# EAGLE design adapter_board (EAGLE 5.03)
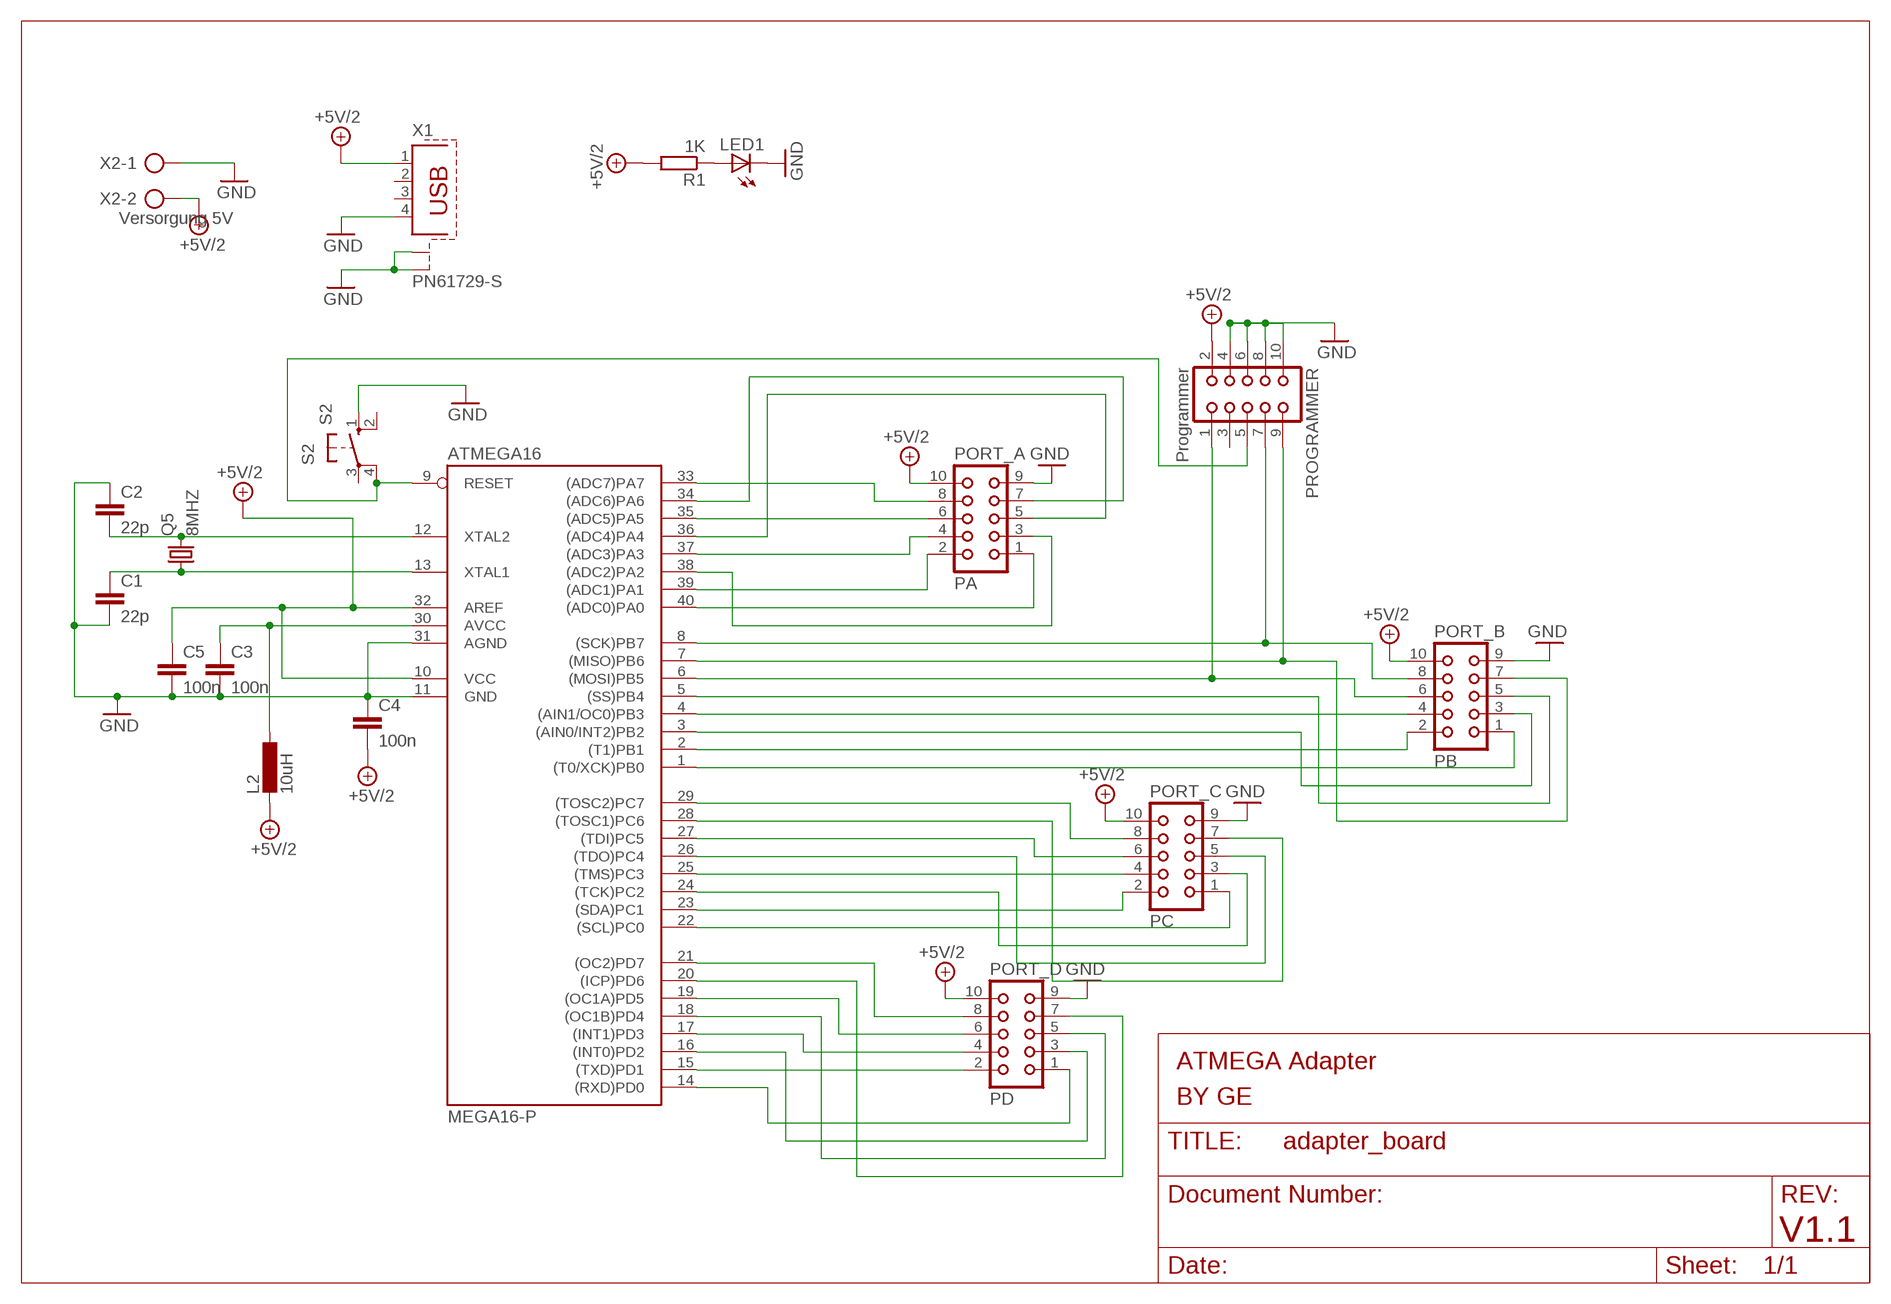
[diagram p0: schematic, sheet 1]

## Parts
ATMEGA16  MEGA16-P  [DIL40]
C1  22p  C2.5/2  [C2.5-2]
C2  22p  C2.5/2  [C2.5-2]
C3  100n  C5/2.5  [C5B2.5]
C4  100n  C2.5/2  [C2.5-2]
C5  100n  C2.5/2  [C2.5-2]
L2  10uH  L-EU0204/5  [0204/5]
LED1  LED3MM  [LED3MM]
PORT_A  PA  CON10  [CON10]
PORT_B  PB  CON10  [CON10]
PORT_C  PC  CON10  [CON10]
PORT_D  PD  CON10  [CON10]
PROGRAMMER  Programmer  CON10  [CON10]
Q5  8MHZ  CRYTALHC18U-V  [HC18U-V]
R1  1K  R-EU_0204/2V  [0204V]
S2  S2  10-XX  [B3F-10XX]
X1  PN61729-S  [PN61729-S]
X2  Versorgung 5V  AK300/2  [AK300/2]

## Nets
2D30: ATMEGA16.30(AVCC) C3.1 L2.1
+5V/2: ATMEGA16.10(VCC) ATMEGA16.32(AREF) C4.2 C5.1 L2.2 PORT_A.10 PORT_B.10 PORT_C.10 PORT_D.10 PROGRAMMER.2 R1.2 X1.1 X2.2
GND: ATMEGA16.11(GND) ATMEGA16.31(AGND) C1.2 C2.1 C3.2 C4.1 C5.2 LED1.K(C) PORT_A.9 PORT_B.9 PORT_C.9 PORT_D.9 PROGRAMMER.4 PROGRAMMER.6 PROGRAMMER.8 PROGRAMMER.10 S2.1(S) X1.4 X1.S1 X1.S2 X2.1
N$1: ATMEGA16.12(XTAL2) C2.2 Q5.2
N$2: ATMEGA16.13(XTAL1) C1.1 Q5.1
N$3: ATMEGA16.9(RESET) PROGRAMMER.5 S2.4(P1)
N$4: ATMEGA16.1((T0/XCK)PB0) PORT_B.1
N$5: ATMEGA16.2((T1)PB1) PORT_B.2
N$6: ATMEGA16.3((AIN0/INT2)PB2) PORT_B.3
N$7: ATMEGA16.4((AIN1/OC0)PB3) PORT_B.4
N$8: ATMEGA16.5((SS)PB4) PORT_B.5
N$9: ATMEGA16.6((MOSI)PB5) PORT_B.6 PROGRAMMER.1
N$10: ATMEGA16.7((MISO)PB6) PORT_B.7 PROGRAMMER.9
N$11: ATMEGA16.8((SCK)PB7) PORT_B.8 PROGRAMMER.7
N$12: ATMEGA16.22((SCL)PC0) PORT_C.1
N$13: ATMEGA16.23((SDA)PC1) PORT_C.2
N$14: ATMEGA16.24((TCK)PC2) PORT_C.3
N$15: ATMEGA16.25((TMS)PC3) PORT_C.4
N$16: ATMEGA16.26((TDO)PC4) PORT_C.5
N$17: ATMEGA16.27((TDI)PC5) PORT_C.6
N$18: ATMEGA16.28((TOSC1)PC6) PORT_C.7
N$19: ATMEGA16.29((TOSC2)PC7) PORT_C.8
N$20: ATMEGA16.14((RXD)PD0) PORT_D.1
N$21: ATMEGA16.15((TXD)PD1) PORT_D.2
N$22: ATMEGA16.16((INT0)PD2) PORT_D.3
N$23: ATMEGA16.17((INT1)PD3) PORT_D.4
N$24: ATMEGA16.18((OC1B)PD4) PORT_D.5
N$25: ATMEGA16.19((OC1A)PD5) PORT_D.6
N$26: ATMEGA16.20((ICP)PD6) PORT_D.7
N$27: ATMEGA16.21((OC2)PD7) PORT_D.8
N$28: ATMEGA16.40((ADC0)PA0) PORT_A.1
N$29: ATMEGA16.39((ADC1)PA1) PORT_A.2
N$30: ATMEGA16.38((ADC2)PA2) PORT_A.3
N$31: ATMEGA16.37((ADC3)PA3) PORT_A.4
N$32: ATMEGA16.36((ADC4)PA4) PORT_A.5
N$33: ATMEGA16.35((ADC5)PA5) PORT_A.6
N$34: ATMEGA16.34((ADC6)PA6) PORT_A.7
N$35: ATMEGA16.33((ADC7)PA7) PORT_A.8
N$36: LED1.A R1.1
Unconnected: PROGRAMMER.3 S2.2(S1) S2.3(P) X1.2 X1.3

## Notes on the sheet
- ATMEGA Adapter
- BY GE
- V1.1

## Library data of the parts
ATMEGA16 = atmel:MEGA16-P: MICROCONTROLLER 16 Kbytes FLASH 1 kbytes SRAM 512 bytes EEPROM USART 8-channel 10 bit ADC Source: avr.lbr
C1-C5 = capacitor-wima:C: CAPACITOR naming: grid - package width
L2 = rcl:L-EU: INDUCTOR, European symbol
LED1 = led:LED: LED OSRAM: - CHIPLED LG R971, LG N971, LY N971, LG Q971, LY Q971, LO R971, LY R971 LH N974, LH R974 LS Q976, LO Q976, LY Q976 LO Q996 - Hyper CHIPLED LW Q18S LB Q993, LB Q99A, LB R99A - SideLED LS A670, LO A670, LY A670, LG A670, LP A670 LB A673, LV A673, LT A673, LW A673 LH A674 LY A675 LS A676, LA A676, LO A676, LY A676, LW A676 LS A679, LY A679, LG A679 - Hyper Micro SIDELED® LS Y876, LA Y876, LO Y876, LY Y876 LT Y87S - SmartLED LW L88C, LW L88S LB L89C, LB L89S, LG L890 LS L89K, LO L89K, LY L89K LS L896, LA L896, LO L896, LY L896 - TOPLED LS T670, LO T670, LY T670, LG T670, LP T670 LSG T670, LSP T670, LSY T670, LOP T670, LYG T670 LG T671, LOG T671, LSG T671 LB T673, LV T673, LT T673, LW T673 LH T674 LS T676, LA T676, LO T676, LY T676, LB T676, LH T676, LSB T676, LW T676 LB T67C, LV T67C, LT T67C, LS T67K, LO T67K, LY T67K, LW E67C LS E67B, LA E67B, LO E67B, LY E67B, LB E67C, LV E67C, LT E67C LW T67C LS T679, LY T679, LG T679 LS T770, LO T770, LY T770, LG T770, LP T770 LB T773, LV T773, LT T773, LW T773 LH T774 LS E675, LA E675, LY E675, LS T675 LS T776, LA T776, LO T776, LY T776, LB T776 LHGB T686 LT T68C, LB T68C - Hyper Mini TOPLED® LB M676 - Mini TOPLED Santana® LG M470 LS M47K, LO M47K, LY M47K Source: http://www.osram.convergy.de LUXEON: - LUMILED® LXK2-PW12-R00, LXK2-PW12-S00, LXK2-PW14-U00, LXK2-PW14-V00 LXK2-PM12-R00, LXK2-PM12-S00, LXK2-PM14-U00 LXK2-PE12-Q00, LXK2-PE12-R00, LXK2-PE12-S00, LXK2-PE14-T00, LXK2-PE14-U00 LXK2-PB12-K00, LXK2-PB12-L00, LXK2-PB12-M00, LXK2-PB14-N00, LXK2-PB14-P00, LXK2-PB14-Q00 LXK2-PR12-L00, LXK2-PR12-M00, LXK2-PR14-Q00, LXK2-PR14-R00 LXK2-PD12-Q00, LXK2-PD12-R00, LXK2-PD12-S00 LXK2-PH12-R00, LXK2-PH12-S00 LXK2-PL12-P00, LXK2-PL12-Q00, LXK2-PL12-R00 Source: www.luxeon.com KINGBRIGHT: KA-3528ASYC Source: www.kingbright.com
PORT_A PORT_B PORT_C PORT_D PROGRAMMER = con-harting:CON10: CONNECTOR
Q5 = crystal:CRYTAL: CRYSTAL
R1 = rcl:R-EU_: RESISTOR, European symbol
S2 = switch-omron:10-XX: OMRON SWITCH
X1 = con-berg:PN61729-S: BERG USB connector
X2 = con-ptr500:AK300/2: CONNECTOR

## Board
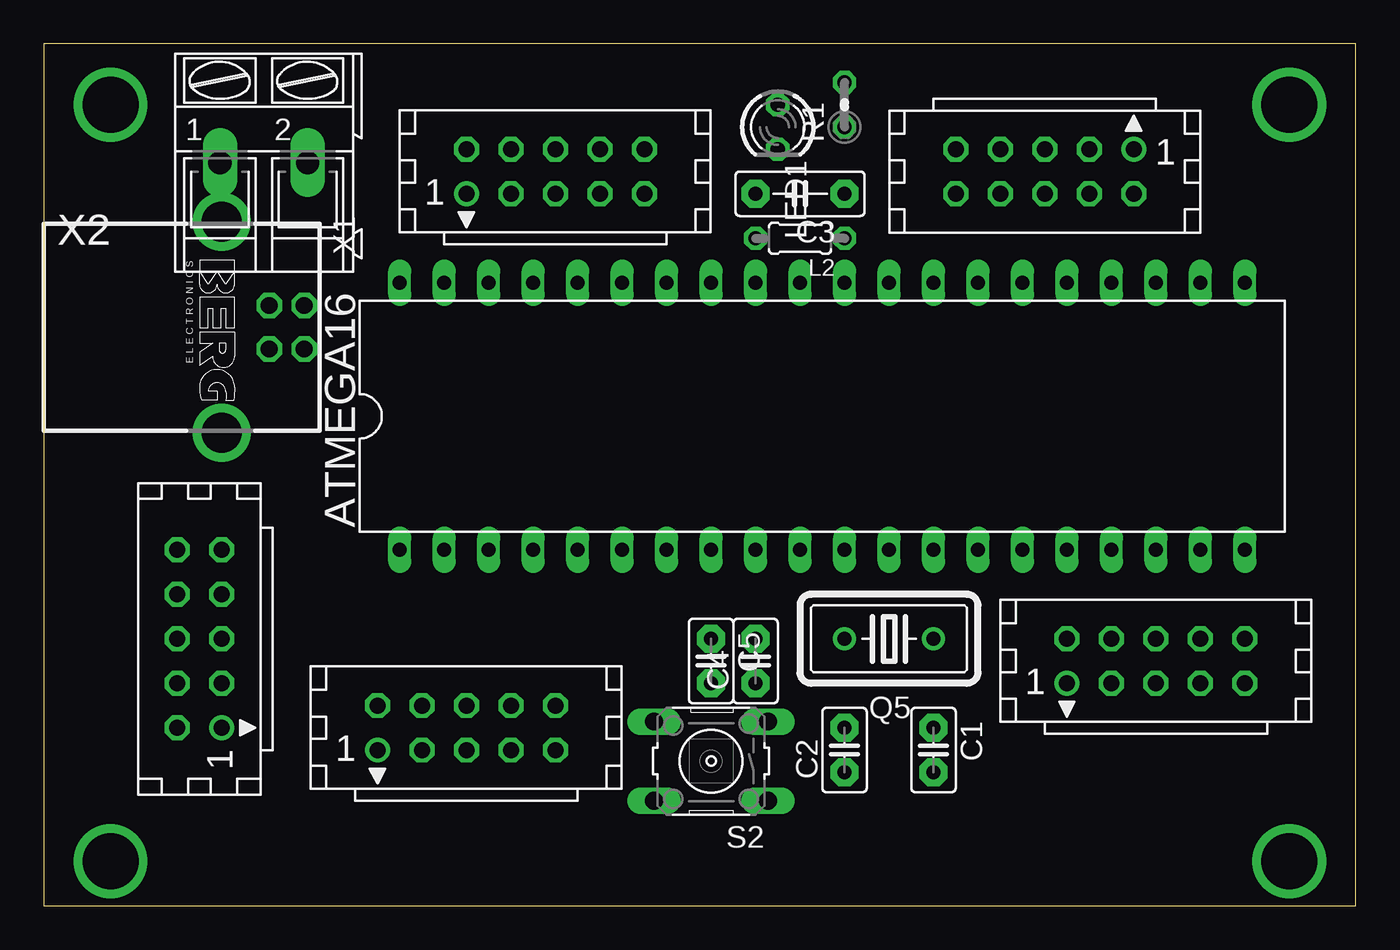
[diagram p1: board, top side]
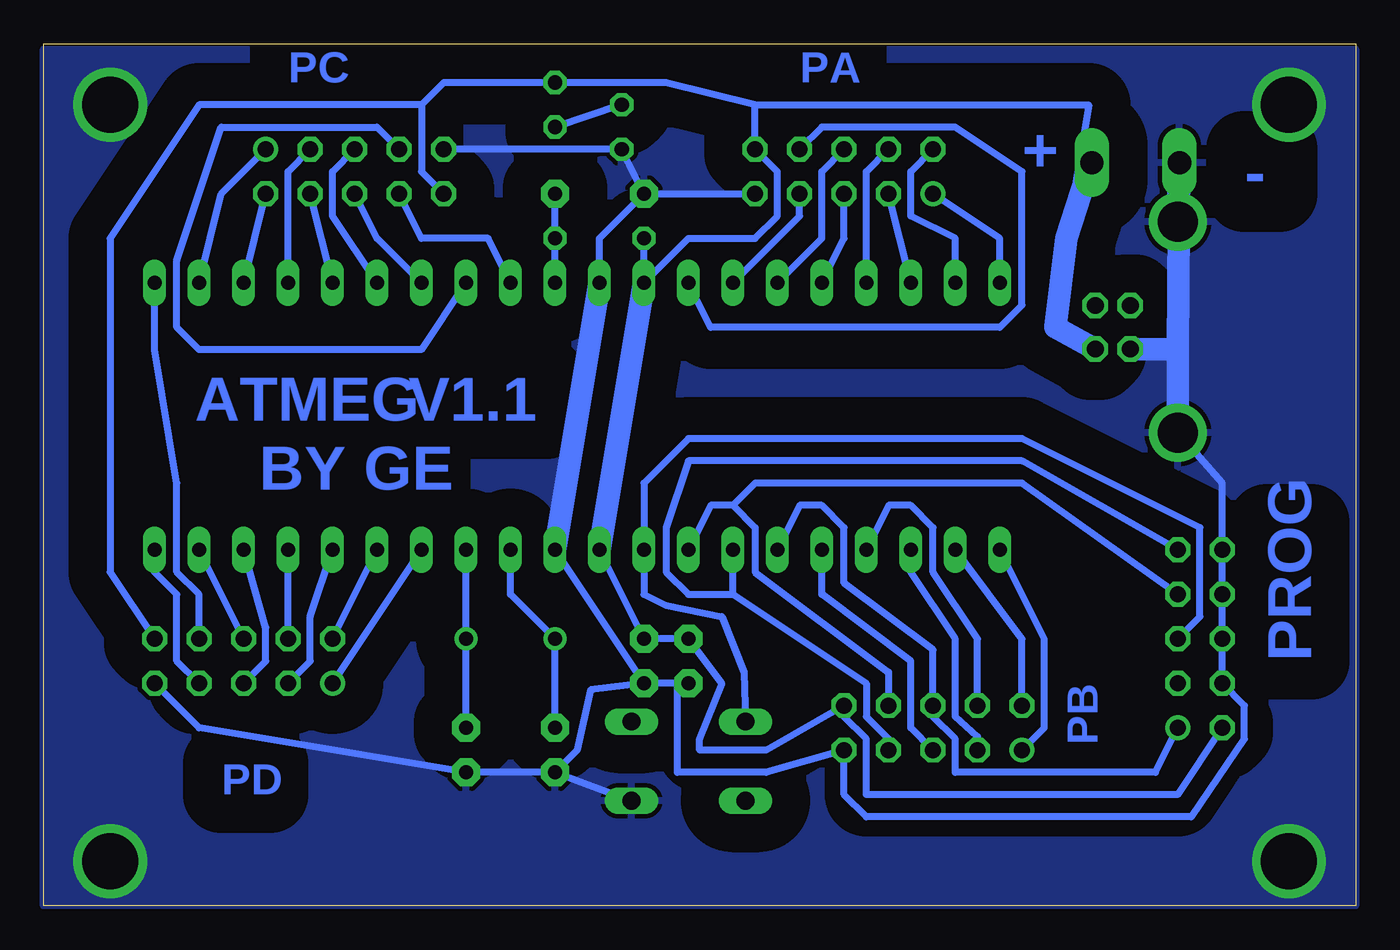
[diagram p2: board, bottom side, seen from below]

Size 74.91 x 49.2 mm. Coordinates in mm from the lower left corner, seen from the top.
Outline: 0,0 74.91,0 74.91,49.2 0,49.2 0,0
Copper layers (1*16): Top 0.035mm / dielectric 1.5mm / Bottom 0.035mm
Design rules "0.35mm": minimum track width 10mil, minimum drill 24mil, track to track 0.35mm, track to pad 0.35mm, pad to pad 0.35mm, via to via 0.35mm, smd to smd 0.35mm, copper to edge 0mil, drill to drill 8mil, minimum pad ring 10mil, minimum via ring 8mil, stop-mask expansion 4mil, vias tented up to drill 0mil, thermal gap 10mil

### Footprints (pad centres in the part's own frame; a part is rotated, then mirrored left to right if it is on the bottom)
DIL40 = drill 0.813 long: 1 -24.13,-7.62; 2 -21.59,-7.62; 3 -19.05,-7.62; 4 -16.51,-7.62; 5 -13.97,-7.62; 6 -11.43,-7.62; 7 -8.89,-7.62; 8 -6.35,-7.62; 9 -3.81,-7.62; 10 -1.27,-7.62; 11 1.27,-7.62; 12 3.81,-7.62; 13 6.35,-7.62; 14 8.89,-7.62; 15 11.43,-7.62; 16 13.97,-7.62; 17 16.51,-7.62; 18 19.05,-7.62; 19 21.59,-7.62; 20 24.13,-7.62; 21 24.13,7.62; 22 21.59,7.62; 23 19.05,7.62; 24 16.51,7.62; 25 13.97,7.62; 26 11.43,7.62; 27 8.89,7.62; 28 6.35,7.62; 29 3.81,7.62; 30 1.27,7.62; 31 -1.27,7.62; 32 -3.81,7.62; 33 -6.35,7.62; 34 -8.89,7.62; 35 -11.43,7.62; 36 -13.97,7.62; 37 -16.51,7.62; 38 -19.05,7.62; 39 -21.59,7.62; 40 -24.13,7.62
C2.5-2 = drill 0.813 pad 1.6 octagon: 1 -1.27,0; 2 1.27,0
C5B2.5 = drill 0.813 pad 1.6 octagon: 1 -2.54,0; 2 2.54,0
0204/5 = drill 0.813 octagon: 1 -2.54,0; 2 2.54,0
LED3MM = drill 0.813 octagon: A -1.27,0; K 1.27,0
CON10 = drill 0.914 round: 1 -5.08,-1.27 | drill 0.914 octagon: 2 -5.08,1.27; 3 -2.54,-1.27; 4 -2.54,1.27; 5 0,-1.27; 6 0,1.27; 7 2.54,-1.27; 8 2.54,1.27; 9 5.08,-1.27; 10 5.08,1.27
HC18U-V = drill 0.813 round: 1 -2.54,0; 2 2.54,0
0204V = drill 0.813 octagon: 1 -1.27,0; 2 1.27,0
B3F-10XX = drill 1.016 long: 1 -3.251,2.261; 2 3.251,2.261; 3 -3.251,-2.261; 4 3.251,-2.261
PN61729-S = drill 0.95 octagon: 1 1.25,4.71; 2 -1.25,4.71; 3 -1.25,2.71; 4 1.25,2.71 | drill 2.3 pad 2.9 round: S1 -6.02,0; S2 6.02,0
AK300/2 = drill 1.321 long: 1 -2.515,0; 2 2.489,0

### Placement (x,y rotation side)
ATMEGA16  44.45,27.94 0 top
C1  50.8,8.89 270 top
C2  45.72,8.89 90 top
C3  43.18,40.64 180 top
C4  40.64,13.97 90 top
C5  38.1,13.97 270 top
L2  43.18,38.1 180 top
LED1  41.91,44.45 270 top
PORT_A  29.21,41.91 0 top
PORT_B  24.13,10.16 0 top
PORT_C  57.15,41.91 180 top
PORT_D  63.5,13.97 0 top
PROGRAMMER  8.89,15.24 90 top
Q5  48.26,15.24 180 top
R1  45.72,45.72 90 top
S2  38.1,8.26 180 top
X1  10.16,33.02 270 top
X2  12.57,42.42 0 top

### Tracks (layer width: path | path; a pad name or v marks a point on that pad's centre or on a via)
2D30
  Bottom 0.406: ATMEGA16.30 L2.1 C3.1
+5V/2
  Bottom 0.406: L2.2 ATMEGA16.32 38.1,38.1 34.29,38.1 33.02,39.37 33.02,41.91 PORT_A.10 34.29,45.72 | PORT_C.10 53.34,41.91 53.34,45.72 | 34.29,45.72 39.37,46.99 R1.2 52.07,46.99 53.34,45.72 | ATMEGA16.10 C4.2 C5.1 36.2,12.7 37.47,9.53 37.47,8.89 33.66,8.89 PORT_B.10 29.21,10.79 27.94,9.53 27.94,6.35 10.16,6.35 PROGRAMMER.2 | 16.51,38.1 15.24,45.72 34.29,45.72 | PORT_D.10 71.12,19.05 71.12,38.1 66.04,45.72 53.34,45.72
  Bottom 1.27: ATMEGA16.10 ATMEGA16.32 | X2.2 15.12,42.44 16.51,38.1 17.14,33.02 X1.1
GND  (via drill 3.2, 3.2 pad 1.27)
  Bottom 0.406: C2.1 S2.1 | C2.1 C1.2 66.04,10.16 PORT_D.9 | C3.2 PORT_A.9 | ATMEGA16.31 43.18,38.1 C3.2 | PORT_C.9 LED1.K C3.2 | C4.1 ATMEGA16.11 | 38.73,12.7 C4.1 | 38.73,12.7 38.73,7.62 33.66,7.62 PORT_B.9 29.21,6.35 27.94,5.08 9.4,5.08 6.35,9.53 6.35,11.43 PROGRAMMER.4 PROGRAMMER.6 PROGRAMMER.8 PROGRAMMER.10 7.62,24.13 X1.S2 | 38.73,12.7 C5.2 | C4.1 43.69,12.32 44.45,8.89 C2.1
  Bottom 1.27: ATMEGA16.11 ATMEGA16.31 | X1.S2 10.17,31.75 | 10.17,31.75 X2.1 X1.S1 | 10.17,31.75 X1.4
  other vias: 3.81,45.72 3.81,2.54 71.12,2.54 71.12,45.72
  pour Bottom (isolate 2.184): 0,0 74.93,0 74.93,48.9 0,48.9
N$1
  Bottom 0.406: ATMEGA16.12 48.26,17.78 Q5.2 C2.2
N$2
  Bottom 0.406: ATMEGA16.13 Q5.1 C1.1
N$3
  Bottom 0.406: PROGRAMMER.5 8.89,16.51 8.89,21.59 19.05,26.67 38.1,26.67 40.64,24.13 ATMEGA16.9 40.64,17.78 39.37,17.14 36.2,16.51 34.92,13.34 S2.4
N$4
  Bottom 0.406: ATMEGA16.1 17.78,15.24 17.78,10.16 PORT_B.1
N$5
  Bottom 0.406: PORT_B.2 19.05,15.24 ATMEGA16.2
N$6
  Bottom 0.406: PORT_B.3 21.59,9.65 22.86,10.79 22.86,15.24 25.4,19.05 ATMEGA16.3
N$7
  Bottom 0.406: PORT_B.4 21.59,15.24 24.13,19.05 24.13,21.59 25.4,22.86 26.67,22.86 ATMEGA16.4
N$8
  Bottom 0.406: ATMEGA16.5 30.48,17.78 25.4,13.97 25.4,10.16 PORT_B.5
N$9
  Bottom 0.406: ATMEGA16.6 31.75,22.86 30.48,22.86 29.21,21.59 29.21,18.41 24.13,14.61 PORT_B.6 24.13,10.79 22.86,9.53 22.86,7.62 11.43,7.62 PROGRAMMER.1
N$10
  Bottom 0.406: PORT_B.7 26.67,9.53 27.94,10.79 27.94,12.7 35.56,17.78 | 35.56,17.78 ATMEGA16.7 | PROGRAMMER.9 19.05,25.4 38.1,25.4 39.37,21.59 39.37,19.05 38.1,17.78 35.56,17.78
N$11
  Bottom 0.406: ATMEGA16.8 36.83,22.86 35.56,22.86 | 35.56,22.86 34.29,21.59 34.29,19.05 26.67,13.34 PORT_B.8 | PROGRAMMER.7 19.05,24.13 34.29,24.13 35.56,22.86
N$12
  Bottom 0.406: PORT_C.1 64.77,40.64 ATMEGA16.22
N$13
  Bottom 0.406: ATMEGA16.23 PORT_C.2
N$14
  Bottom 0.406: PORT_C.3 60.96,41.91 ATMEGA16.24
N$15
  Bottom 0.406: ATMEGA16.25 PORT_C.4
N$16
  Bottom 0.406: PORT_C.5 58.42,41.91 58.42,39.37 ATMEGA16.26
N$17
  Bottom 0.406: PORT_C.6 55.88,38.1 ATMEGA16.27
N$18
  Bottom 0.406: PORT_C.7 55.88,44.45 64.77,44.45 67.31,36.83 67.31,33.02 66.04,31.75 53.34,31.75 ATMEGA16.28
N$19
  Bottom 0.406: PORT_C.8 53.34,38.1 49.53,38.1 ATMEGA16.29
N$20
  Bottom 0.406: PORT_D.1 ATMEGA16.14
N$21
  Bottom 0.406: PORT_D.2 ATMEGA16.15
N$22
  Bottom 0.406: ATMEGA16.16 59.69,16.51 59.69,13.97 PORT_D.3
N$23
  Bottom 0.406: PORT_D.4 ATMEGA16.17
N$24
  Bottom 0.406: ATMEGA16.18 62.23,15.88 62.23,13.97 PORT_D.5
N$25
  Bottom 0.406: PORT_D.6 ATMEGA16.19
N$26
  Bottom 0.406: PORT_D.7 67.31,13.97 67.31,17.78 68.58,19.05 ATMEGA16.20
N$27
  Bottom 0.406: PORT_D.8 66.04,17.78 67.31,19.05 67.31,24.13 68.58,31.75 ATMEGA16.21
N$28
  Bottom 0.406: PORT_A.1 20.32,38.1 ATMEGA16.40
N$29
  Bottom 0.406: PORT_A.2 25.4,41.91 25.4,39.37 22.86,38.1 ATMEGA16.39
N$30
  Bottom 0.406: ATMEGA16.38 PORT_A.3
N$31
  Bottom 0.406: PORT_A.4 27.94,41.91 ATMEGA16.37
N$32
  Bottom 0.406: PORT_A.5 29.21,38.1 ATMEGA16.36
N$33
  Bottom 0.406: PORT_A.6 30.48,41.91 30.48,38.1 ATMEGA16.35
N$34
  Bottom 0.406: PORT_A.7 31.75,39.37 ATMEGA16.34
N$35
  Bottom 0.406: ATMEGA16.33 36.83,33.02 20.32,33.02 19.05,34.29 19.05,41.91 22.86,44.45 30.48,44.45 PORT_A.8
N$36
  Bottom 0.406: LED1.A R1.1

### Text on the board
Bottom: PA | PC | + | - | V1.1 | ATMEG | BY GE | PROG | PB | PD